# EAGLE design M4_Shield_Solar_Litio_V1.0 (EAGLE 9.5.2)
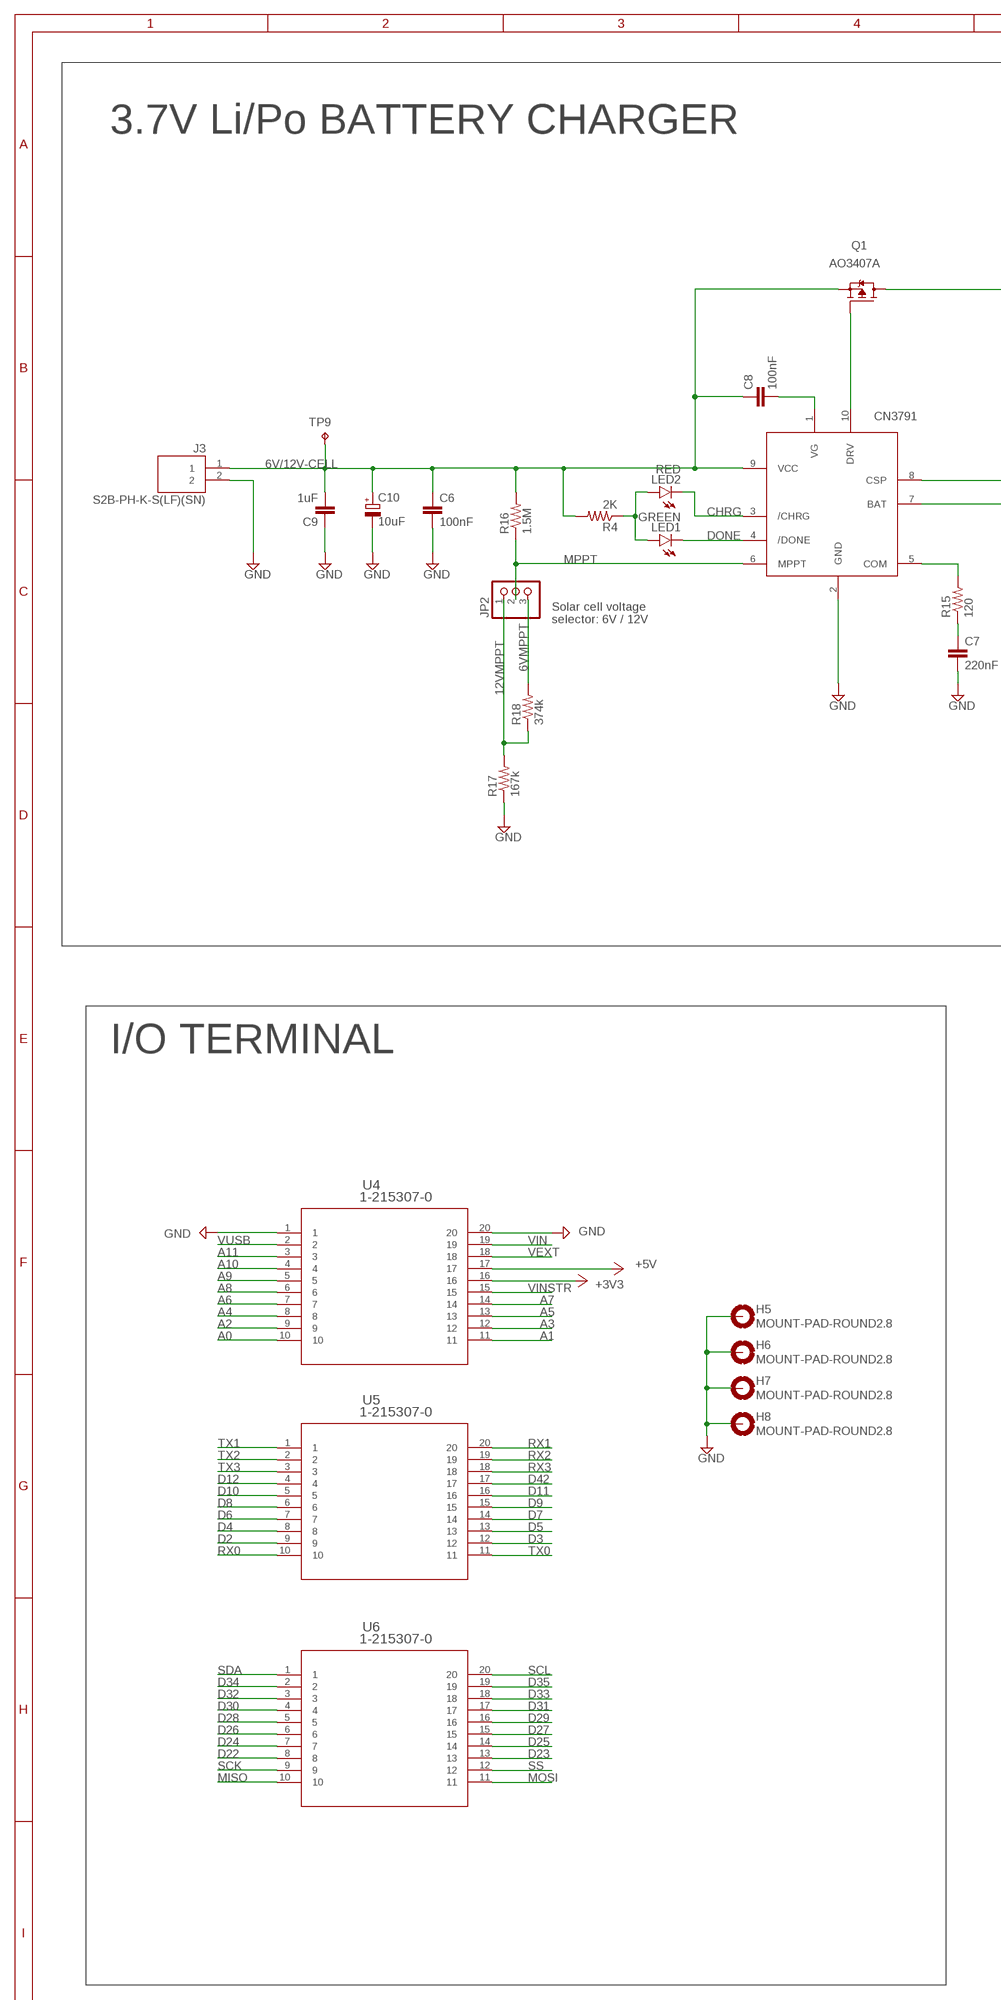
[diagram p0: schematic, sheet 1, part 1 of 2]
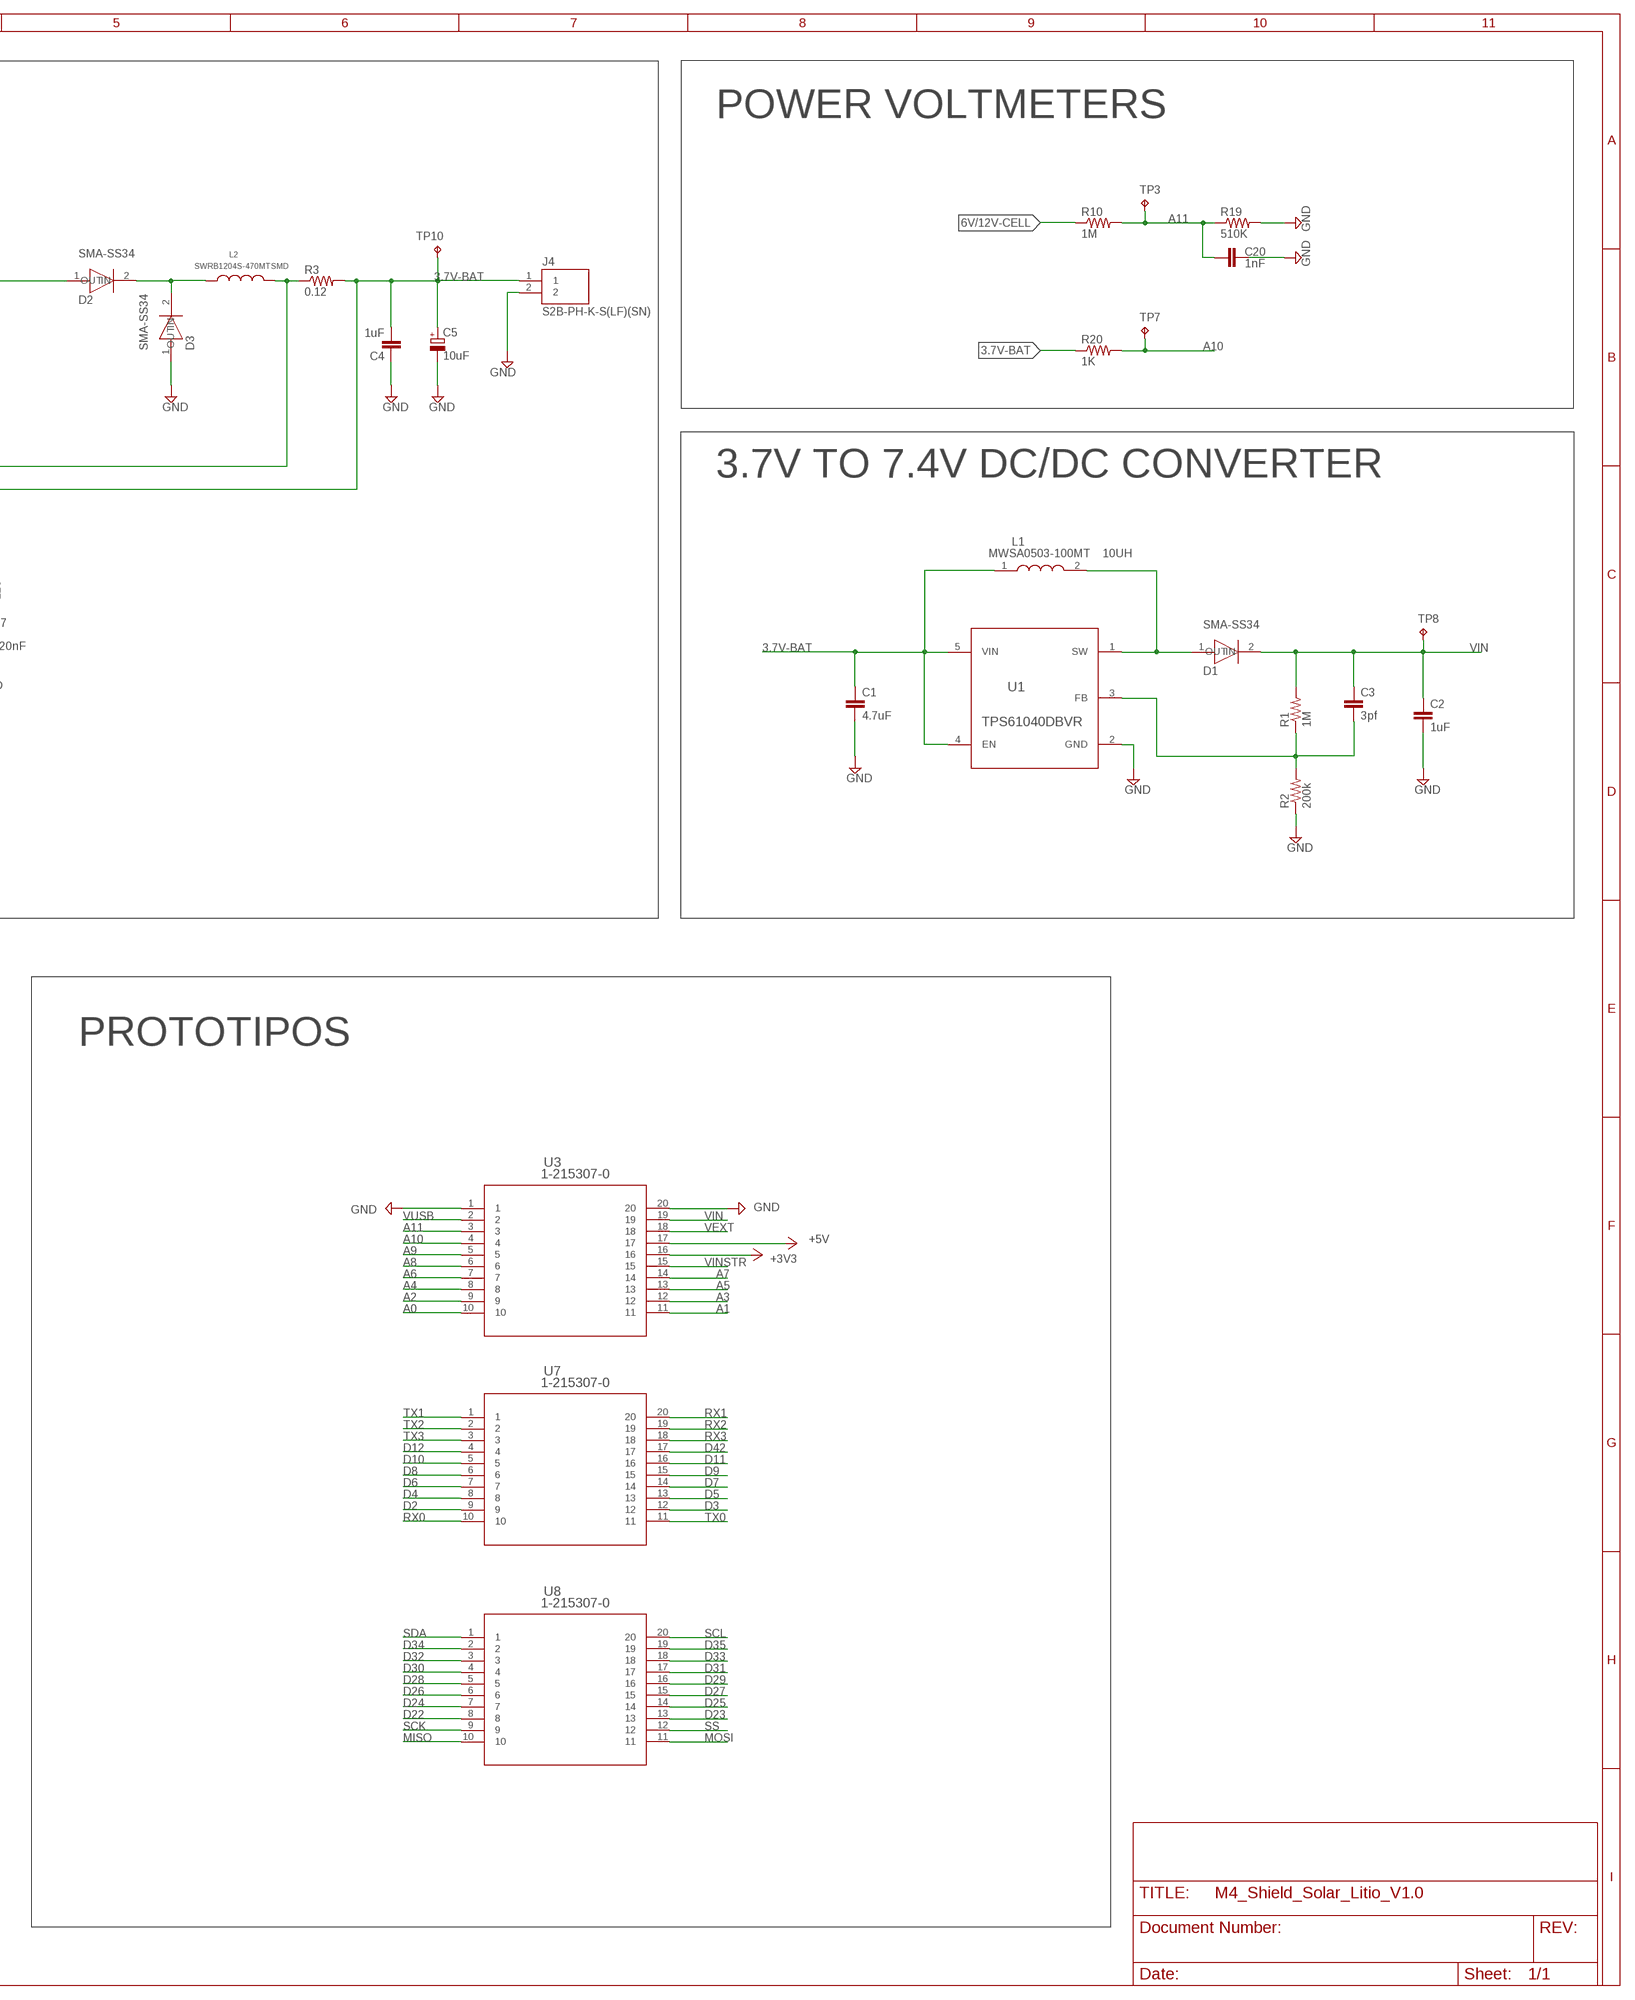
[diagram p1: schematic, sheet 1, part 2 of 2]

## Parts
C1  4.7uF  C-EUC0603K  [C0603K]
C2  1uF  C-EUC0603K  [C0603K]
C3  3pf  C-EUC0603K  [C0603K]
C4  1uF  C-EUC0603K  [C0603K]
C5  10uF  CPOL-EU153CLV-0505  [153CLV-0505]
C6  100nF  C-EUC0603K  [C0603K]
C7  220nF  C-EUC0603K  [C0603K]
C8  100nF  C-EUC0603K  [C0603K]
C9  1uF  C-EUC0603K  [C0603K]
C10  10uF  CPOL-EU153CLV-0505  [153CLV-0505]
C20  1nF  C-EUC0603K  [C0603K]
D1  SMA-SS34  [SMA-SS34]
D2  SMA-SS34  [SMA-SS34]
D3  SMA-SS34  [SMA-SS34]
H5  MOUNT-PAD-ROUND2.8  [2,8-PAD]
H6  MOUNT-PAD-ROUND2.8  [2,8-PAD]
H7  MOUNT-PAD-ROUND2.8  [2,8-PAD]
H8  MOUNT-PAD-ROUND2.8  [2,8-PAD]
J3  S2B-PH-K-S(LF)(SN)  [JST_S2B-PH-K-S(LF)(SN)]
J4  S2B-PH-K-S(LF)(SN)  [JST_S2B-PH-K-S(LF)(SN)]
JP2  PINHD-1X3/90  [1X03/90]
L1  MWSA0503-100MT 10UH  MWSA0503  [MWSA0503]
L2  SWRB1204S-470MTSMD  [SWRB1204S-470MT]
LED1  GREEN  LEDCHIPLED_0603  [CHIPLED_0603]
LED2  RED  LEDCHIPLED_0603  [CHIPLED_0603]
Q1  AO3407A  [SOT95P280X125-3N]
R1  1M  R-US_R0603  [R0603]
R2  200k  R-US_R0603  [R0603]
R3  0.12  R-US_R0805  [R0805]
R4  2K  R-US_R0603  [R0603]
R10  1M  R-US_R0603  [R0603]
R15  120  R-US_R0603  [R0603]
R16  1.5M  R-US_R0603  [R0603]
R17  167k  R-US_R0603  [R0603]
R18  374k  R-US_R0603  [R0603]
R19  510K  R-US_R0603  [R0603]
R20  1K  R-US_R0603  [R0603]
TP3  TPB1,27  [B1,27]
TP7  TPB1,27  [B1,27]
TP8  TPB1,27  [B1,27]
TP9  TPB1,27  [B1,27]
TP10  TPB1,27  [B1,27]
U1  TPS61040DBVR  [DBV0005A]
U2  CN3791  [CN3791]
U3  1-215307-0  [1-215307-0]
U4  1-215307-0  [1-215307-0]
U5  1-215307-0  [1-215307-0]
U6  1-215307-0  [1-215307-0]
U7  1-215307-0  [1-215307-0]
U8  1-215307-0  [1-215307-0]

## Nets
3.7V-BAT: C1.1 C4.2 C5.+ J4.1 L1.1 R3.2 R20.1 TP10.TP U1.4(EN) U1.5(VIN) U2.7(BAT)
6V/12V-CELL: C6.1 C8.1 C9.2 C10.+ J3.1 Q1.2(S) R4.2 R10.1 R16.2 TP9.TP U2.9(VCC)
6VMPPT: JP2.3 R18.2
12VMPPT: JP2.1 R17.2 R18.1
+3V3: U3.16 U4.16
+5V: U3.17 U4.17
A0: U3.10 U4.10
A1: U3.11 U4.11
A2: U3.9 U4.9
A3: U3.12 U4.12
A4: U3.8 U4.8
A5: U3.13 U4.13
A6: U3.7 U4.7
A7: U3.14 U4.14
A8: U3.6 U4.6
A9: U3.5 U4.5
A10: R20.2 TP7.TP U3.4 U4.4
A11: C20.1 R10.2 R19.1 TP3.TP U3.3 U4.3
CHRG: LED2.C U2.3(/CHRG)
D2: U5.9 U7.9
D3: U5.12 U7.12
D4: U5.8 U7.8
D5: U5.13 U7.13
D6: U5.7 U7.7
D7: U5.14 U7.14
D8: U5.6 U7.6
D9: U5.15 U7.15
D10: U5.5 U7.5
D11: U5.16 U7.16
D12: U5.4 U7.4
D22: U6.8 U8.8
D23: U6.13 U8.13
D24: U6.7 U8.7
D25: U6.14 U8.14
D26: U6.6 U8.6
D27: U6.15 U8.15
D28: U6.5 U8.5
D29: U6.16 U8.16
D30: U6.4 U8.4
D31: U6.17 U8.17
D32: U6.3 U8.3
D33: U6.18 U8.18
D34: U6.2 U8.2
D35: U6.19 U8.19
D42: U5.17 U7.17
DONE: LED1.C U2.4(/DONE)
GND: C1.2 C2.2 C4.1 C5.- C6.2 C7.2 C9.1 C10.- C20.2 D3.1(IN) H5.B2,8(MOUNT) H6.B2,8(MOUNT) H7.B2,8(MOUNT) H8.B2,8(MOUNT) J3.2 J4.2 R2.1 R17.1 R19.2 U1.2(GND) U2.2(GND) U3.1 U3.20 U4.1 U4.20
MISO: U6.10 U8.10
MOSI: U6.11 U8.11
MPPT: JP2.2 R16.1 U2.6(MPPT)
N$1: D1.1(IN) L1.2 U1.1(SW)
N$2: D2.2(OUT) D3.2(OUT) L2.1
N$3: C3.2 R1.1 R2.2 U1.3(FB)
N$4: L2.2 R3.1 U2.8(CSP)
N$5: R15.2 U2.5(COM)
N$6: D2.1(IN) Q1.3(D)
N$7: Q1.1(G) U2.10(DRV)
N$12: LED1.A LED2.A R4.1
N$18: C7.1 R15.1
N$22: C8.2 U2.1(VG)
RX0: U5.10 U7.10
RX1: U5.20 U7.20
RX2: U5.19 U7.19
RX3: U5.18 U7.18
SCK: U6.9 U8.9
SCL: U6.20 U8.20
SDA: U6.1 U8.1
SS: U6.12 U8.12
TX0: U5.11 U7.11
TX1: U5.1 U7.1
TX2: U5.2 U7.2
TX3: U5.3 U7.3
VEXT: U3.18 U4.18
VIN: C2.1 C3.1 D1.2(OUT) R1.2 TP8.TP U3.19 U4.19
VINSTR: U3.15 U4.15
VUSB: U3.2 U4.2

## Notes on the sheet
- 3.7V Li/Po BATTERY CHARGER | POWER VOLTMETERS
- 3.7V TO 7.4V DC/DC CONVERTER
- Solar cell voltage 
  selector: 6V / 12V
- I/O TERMINAL
- PROTOTIPOS

## Library data of the parts
C1-C4 C6-C9 C20 = rcl:C-EU: CAPACITOR, European symbol; SPICEPREFIX: C
C5 C10 = rcl:CPOL-EU: POLARIZED CAPACITOR, European symbol; SPICEPREFIX: C
D1-D3 = SMA-SS34:SMA-SS34
H5-H8 = holes:MOUNT-PAD-ROUND: MOUNTING PAD, round
J3 J4 = S2B-PH-K-S_LF__SN_:S2B-PH-K-S(LF)(SN): PH Series 2 Position 2.0 mm Through Hole Side Entry Shrouded Header; DESCRIPTION: Connector Header Through Hole, Right Angle 2 position; DIGI-KEY_PART_NUMBER: 455-1719-ND; DIGI-KEY_PURCHASE_URL: https://www.digikey.com/product-detail/en/jst-sales-america-inc/S2B-PH-K-S_LF__SN_/455-1719-ND/926626?utm_source=snapeda&utm_medium=aggregator&utm_campaign=symbol; MF: JST Sales America Inc.; MP: S2B-PH-K-S_LF__SN_; PACKAGE: Custom Package JST Sales America Inc.
JP2 = pinhead:PINHD-1X3: PIN HEADER
L1 = MWSA0503:MWSA0503: Molded power inductors Source: Datasheet <https://datasheet.lcsc.com/szlcsc/Sunlord-MWSA0503-100MT_C139506.pdf>; DESCRIPTION: Molded power inductors; HEIGHT: 3mm; MANUFACTURER_NAME: SUNLORD; MANUFACTURER_PART_NUMBER: MWSA0503
L2 = SWRB1204S-470MT:SWRB1204S-470MT
LED1 LED2 = led:LED: LED OSRAM: - CHIPLED LG R971, LG N971, LY N971, LG Q971, LY Q971, LO R971, LY R971 LH N974, LH R974 LS Q976, LO Q976, LY Q976 LO Q996 - Hyper CHIPLED LW Q18S LB Q993, LB Q99A, LB R99A - SideLED LS A670, LO A670, LY A670, LG A670, LP A670 LB A673, LV A673, LT A673, LW A673 LH A674 LY A675 LS A676, LA A676, LO A676, LY A676, LW A676 LS A679, LY A679, LG A679 - Hyper Micro SIDELED® LS Y876, LA Y876, LO Y876, LY Y876 LT Y87S - SmartLED LW L88C, LW L88S LB L89C, LB L89S, LG L890 LS L89K, LO L89K, LY L89K LS L896, LA L896, LO L896, LY L896 - TOPLED LS T670, LO T670, LY T670, LG T670, LP T670 LSG T670, LSP T670, LSY T670, LOP T670, LYG T670 LG T671, LOG T671, LSG T671 LB T673, LV T673, LT T673, LW T673 LH T674 LS T676, LA T676, LO T676, LY T676, LB T676, LH T676, LSB T676, LW T676 LB T67C, LV T67C, LT T67C, LS T67K, LO T67K, LY T67K, LW E67C LS E67B, LA E67B, LO E67B, LY E67B, LB E67C, LV E67C, LT E67C LW T67C LS T679, LY T679, LG T679 LS T770, LO T770, LY T770, LG T770, LP T770 LB T773, LV T773, LT T773, LW T773 LH T774 LS E675, LA E675, LY E675, LS T675 LS T776, LA T776, LO T776, LY T776, LB T776 LHGB T686 LT T68C, LB T68C - Hyper Mini TOPLED® LB M676 - Mini TOPLED Santana® LG M470 LS M47K, LO M47K, LY M47K Source: http://www.osram.convergy.de LUXEON: - LUMILED® LXK2-PW12-R00, LXK2-PW12-S00, LXK2-PW14-U00, LXK2-PW14-V00 LXK2-PM12-R00, LXK2-PM12-S00, LXK2-PM14-U00 LXK2-PE12-Q00, LXK2-PE12-R00, LXK2-PE12-S00, LXK2-PE14-T00, LXK2-PE14-U00 LXK2-PB12-K00, LXK2-PB12-L00, LXK2-PB12-M00, LXK2-PB14-N00, LXK2-PB14-P00, LXK2-PB14-Q00 LXK2-PR12-L00, LXK2-PR12-M00, LXK2-PR14-Q00, LXK2-PR14-R00 LXK2-PD12-Q00, LXK2-PD12-R00, LXK2-PD12-S00 LXK2-PH12-R00, LXK2-PH12-S00 LXK2-PL12-P00, LXK2-PL12-Q00, LXK2-PL12-R00 Source: www.luxeon.com KINGBRIGHT: KA-3528ASYC Source: www.kingbright.com
Q1 = AO3407A:AO3407A: Transistor: P-MOSFET; unipolar; -30V; -4.3A; 1.4W; DESCRIPTION: P-Channel 30V 4.3A (Ta) 1.4W (Ta) Surface Mount SOT-23-3L; DIGI-KEY_PART_NUMBER: 785-1006-1-ND; DIGIKEY-PURCHASE-URL: https://snapeda.com/shop?store=DigiKey&id=547767; MF: Alpha &; MP: AO3407A; PACKAGE: SOT-23 Alpha &amp; Omega Semiconductor
R1-R4 R10 R15-R20 = rcl:R-US_: RESISTOR, American symbol; SPICEPREFIX: R
TP3 TP7-TP10 = testpad:TP: Test pad
U1 = TPS61040DBVR:TPS61040DBVR; COMPTYPE: IC; MANUFACTURER: Texas Instruments; MOUNTTYPE: SMT; PACKAGEREFERENCE: DBV0005A; PARTNUMBER: TPS61040DBVR; PIN_COUNT: 5; REFDES: RefDes; ROHS: Y; SYMBOLVERISON: 2014-09-09; TYPE: TYPE; VALUE: Value
U2 = CN3791:CN3791
U3-U8 = 1-215307-0:1-215307-0; BUILT_BY: EMA_UL_Team; MANUFACTURER_PART_NUMBER: 1-215307-0; VENDOR: TE Connectivity

## Board
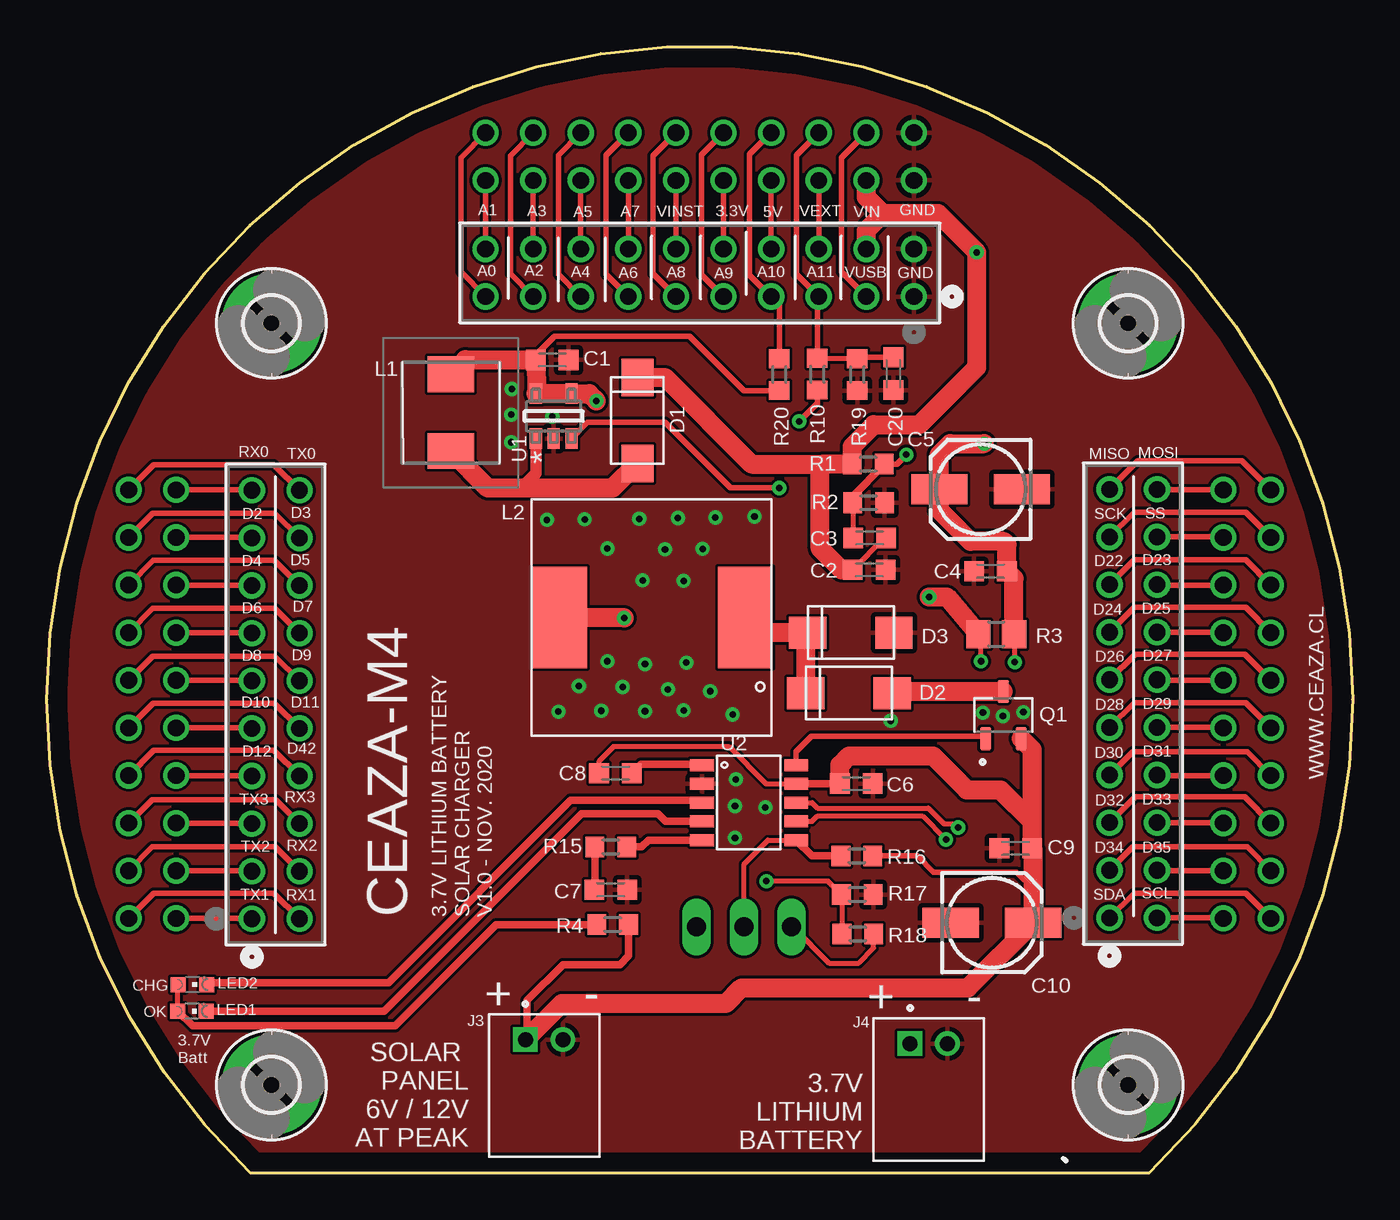
[diagram p2: board, top side]
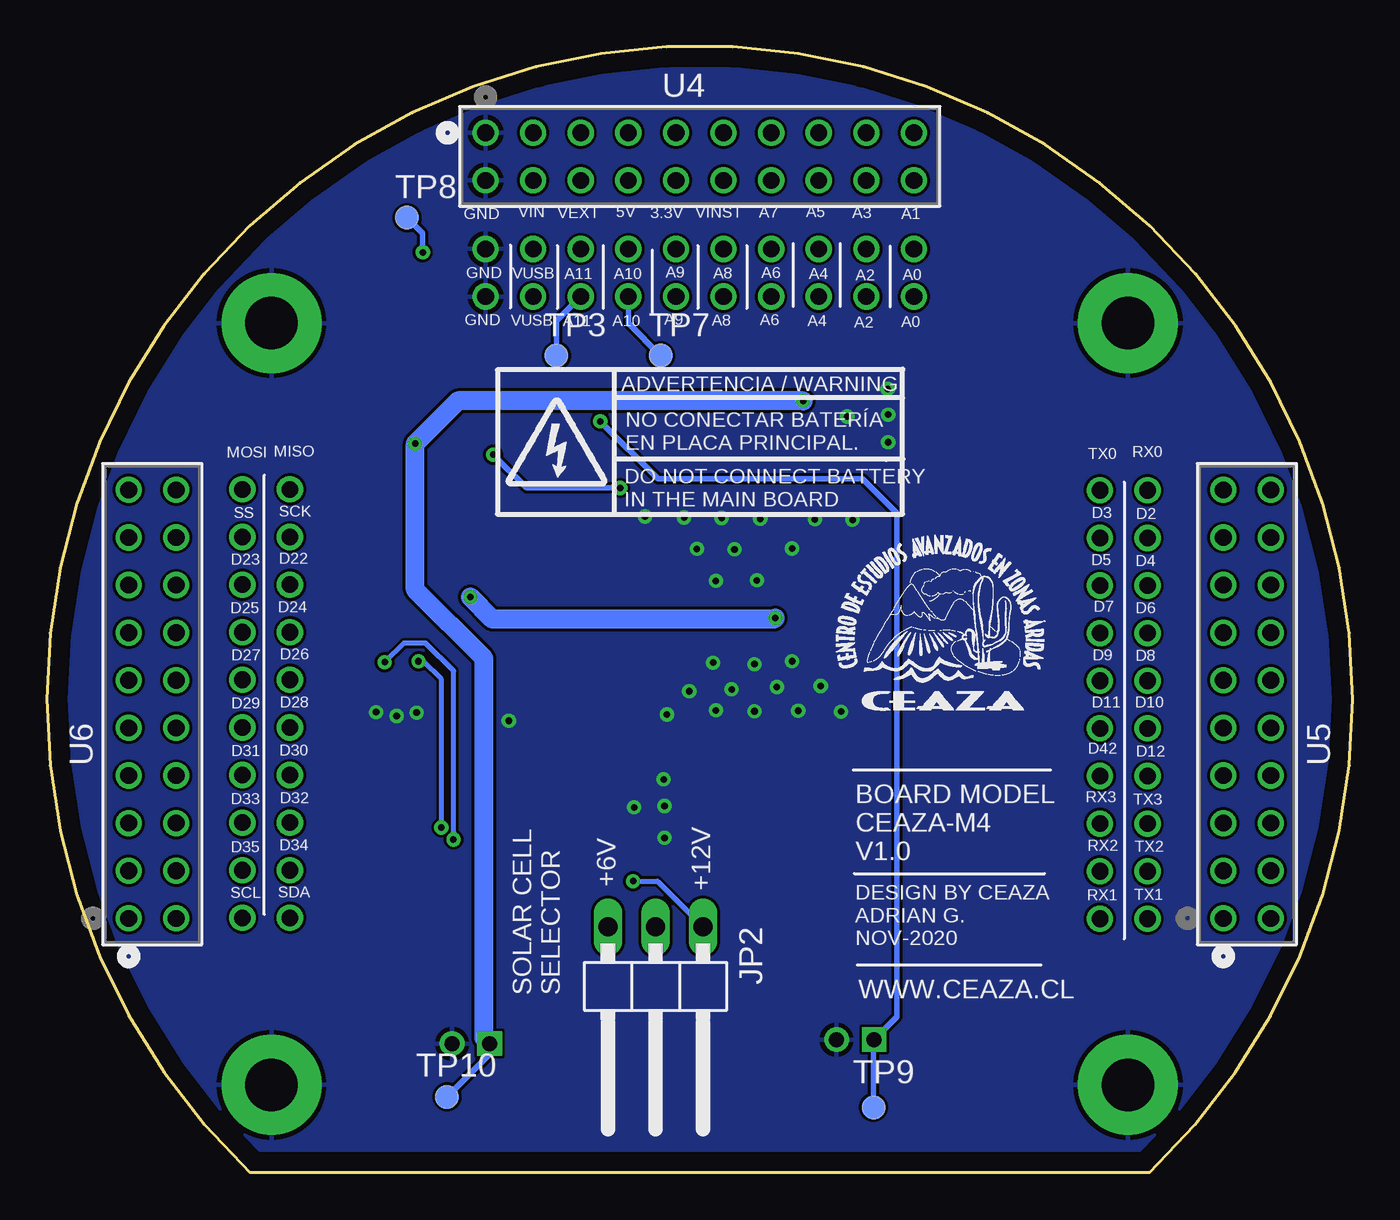
[diagram p3: board, bottom side, seen from below]

Size 69.69 x 60.06 mm. Coordinates in mm from the lower left corner, seen from the top.
Outline: 10.85,0 58.85,0 arc273 10.85,0
Copper layers (1*16): Top 0.035mm / dielectric 1.5mm / Bottom 0.035mm
Design rules "default *": minimum track width 6mil, minimum drill 0.35mm, track to track 6mil, track to pad 6mil, pad to pad 6mil, via to via 6mil, smd to smd 6mil, copper to edge 40mil, drill to drill 6mil, minimum pad ring 10mil, minimum via ring 8mil, stop-mask expansion 2mil, vias tented up to drill 24mil, thermal gap 10mil

### Footprints (pad centres in the part's own frame; a part is rotated, then mirrored left to right if it is on the bottom)
C0603K = smd 1.05 x 1.08: 1 -0.875,0; 2 0.875,0
153CLV-0505 = smd 3 x 1.6: + 2.2,0; - -2.2,0
SMA-SS34 = smd 2 x 1.7: 1 0,-1.4; 2 4.6,-1.4
2,8-PAD = drill 2.8 pad 5.334: B2,8 0,0
JST_S2B-PH-K-S(LF)(SN) = drill 0.8 square: 1 -1,0 | drill 0.8: 2 1,0
1X03/90 = drill 1.016 long: 1 -2.54,-3.81; 2 0,-3.81; 3 2.54,-3.81
MWSA0503 = smd 1.9 x 2.5: 1 -2.05,0; 2 2.05,0
SWRB1204S-470MT = smd 2.9 x 5.4: 1 -5.2,0; 2 4.7,0
CHIPLED_0603 = smd 0.8 x 0.8: A 0,-0.75; C 0,0.75
SOT95P280X125-3N = smd 1.21 x 0.59: 1 -1.255,0.95; 2 -1.255,-0.95; 3 1.255,0
R0603 = smd 1 x 1.1: 1 -0.85,0; 2 0.85,0
R0805 = smd 1.3 x 1.5: 1 -0.95,0; 2 0.95,0
B1,27 = smd 1.27 x 1.27: TP 0,0
DBV0005A = smd 1.1 x 0.65: 1 -1.2,0.95; 2 -1.2,0; 3 -1.2,-0.95; 4 1.2,-0.95; 5 1.2,0.95
CN3791 = smd 1.27 x 0.635: 1 -2.5,1.9; 2 -2.5,0.9; 3 -2.5,-0.1; 4 -2.5,-1.1; 5 -2.5,-2.1; 6 2.53,-2.1; 7 2.53,-1.1; 8 2.53,-0.1; 9 2.53,0.9; 10 2.53,1.9
1-215307-0 = drill 0.889 pad 1.397: 1 -22.86,2.54; 2 -20.32,2.54; 3 -17.78,2.54; 4 -15.24,2.54; 5 -12.7,2.54; 6 -10.16,2.54; 7 -7.62,2.54; 8 -5.08,2.54; 9 -2.54,2.54; 10 0,2.54; 11 0,0; 12 -2.54,0; 13 -5.08,0; 14 -7.62,0; 15 -10.16,0; 16 -12.7,0; 17 -15.24,0; 18 -17.78,0; 19 -20.32,0; 20 -22.86,0

### Placement (x,y rotation side)
C1  26.97,43.36 0 top
C2  43.89,32.16 0 top
C3  43.91,33.86 180 top
C4  50.37,32.09 0 top
C5  49.83,36.46 180 top
C6  43.2,20.76 0 top
C7  30.1,15.09 0 top
C8  30.35,21.32 0 top
C9  51.71,17.3 0 top
C10  50.44,13.34 0 top
C20  45.18,42.63 270 top
D1  30.12,37.83 90 top
D2  45.11,24.19 180 top
D3  45.21,27.41 180 top
H5  57.71,45.32 0 top
H6  11.99,45.32 0 top
H7  11.99,4.68 0 top
H8  57.71,4.68 0 top
J3  26.54,7.09 0 top
J4  47.06,6.89 0 top
JP2  37.21,9.3 180 bottom
L1  21.56,40.54 270 top
L2  32.08,29.62 180 top
LED1  7.74,8.62 270 top
LED2  7.77,10.04 270 top
Q1  51.05,24.42 90 top
R1  43.84,37.8 180 top
R2  43.86,35.74 180 top
R3  50.67,28.73 0 top
R4  30.2,13.24 0 top
R10  41.12,42.6 90 top
R15  30.1,17.38 0 top
R16  43.23,16.9 0 top
R17  43.25,14.84 180 top
R18  43.28,12.73 0 top
R19  43.25,42.58 270 top
R20  39.09,42.58 90 top
TP3  42.49,43.59 0 bottom
TP7  36.93,43.59 0 bottom
TP8  50.47,50.96 0 bottom
TP9  25.57,3.49 0 bottom
TP10  48.33,4.04 0 bottom
U1  27.05,40.37 90 top
U2  37.46,19.84 0 top
U3  23.42,49.28 180 top
U4  23.42,52.94 0 bottom
U5  4.37,36.43 90 bottom
U6  62.79,36.43 90 bottom
U7  13.48,36.4 90 top
U8  59.26,36.46 90 top

### Tracks (layer width: path | path; a pad name or v marks a point on that pad's centre or on a via)
3.7V-BAT  (via drill 0.35)
  Top 0.254: U2.7 40.84,18.74 41.13,19.04 46.72,19.04 v47.99,17.77 | v51.66,27.23 51.66,28.69 R3.2
  Top 0.305: R20.1 37.19,41.73 34.29,44.63 27.09,44.63 26.1,43.64 C1.1
  Top 1.016: 26.13,41.6 C1.1 22.34,43.38 L1.1 | 26.13,41.6 U1.5 | 26.13,41.6 26.17,41.57 U1.4 28.95,41.57 v29.33,41.18 | R3.2 51.62,31.71 C4.2 51.24,33.52 51.08,33.69 49.3,33.69 47.63,35.35 C5.+ 47.63,38.32 48.21,38.89 v50.03,38.89
  Bottom 0.254: v47.99,17.77 47.99,18.13 47.98,18.14 47.98,26.77 49.47,28.26 50.64,28.26 v51.66,27.23
  Bottom 0.305: TP10.TP 46.06,6.31 J4.1
  Bottom 1.016: J4.1 46.37,7.19 46.37,27.44 50.03,31.1 v50.03,38.89 47.75,41.18 v29.33,41.18
6V/12V-CELL  (via drill 0.35)
  Top 0.254: C8.1 29.47,21.95 30.26,22.74 36.39,22.74 38.39,20.74 U2.9
  Top 0.305: R16.2 46.45,16.9 47.32,16.03 51.75,16.03 52.64,15.14 | C9.2 52.59,18.08 | R10.1 41.12,41.05 v40.15,40.09
  Top 0.406: U2.9 40.01,20.76 C6.1 | J3.1 25.64,7.19 25.64,9.2 27.54,11.1 30.59,11.1 31.05,11.56 R4.2
  Top 1.016: J3.1 27.47,9.02 36.24,9.02 37.08,9.86 49.16,9.86 C10.+ 52.64,15.14 52.64,17.25 C9.2 | C9.2 52.59,17.88 | C6.1 42.33,21.74 42.82,22.23 47.29,22.23 49.09,20.43 50.9,20.43 52.59,18.74 | C9.2 52.59,18.74 | 52.59,18.74 52.59,22.57 Q1.2
  Bottom 0.305: TP9.TP 25.57,7.06 J3.1 24.32,8.31 24.32,35.17 26.16,37.01 37.08,37.01 v40.15,40.09
6VMPPT
  Top 0.254: JP2.3 39.82,13.11 41.75,11.18 43.33,11.18 44.13,11.98 R18.2
12VMPPT  (via drill 0.35)
  Top 0.254: R18.1 42.43,14.81 R17.2 41.69,15.55 v38.4,15.55
  Bottom 0.254: v38.4,15.55 37.11,15.55 JP2.1
+3V3
  Top 0.305: U4.16 U3.16
+5V
  Top 0.305: U3.17 U4.17
A0
  Top 0.305: U3.10 22.09,48.06 22.09,54.16 U4.10
A1
  Top 0.305: U3.11 U4.11
A2
  Top 0.305: U3.9 24.74,47.96 24.74,54.26 U4.9
A3
  Top 0.305: U4.12 U3.12
A4
  Top 0.305: U3.8 27.3,47.94 27.3,54.29 U4.8
A5
  Top 0.305: U3.13 U4.13
A6
  Top 0.305: U3.7 29.84,47.94 29.84,54.29 U4.7
A7
  Top 0.305: U4.14 U3.14
A8
  Top 0.305: U3.6 32.36,47.96 32.36,54.26 U4.6
A9
  Top 0.305: U3.5 34.95,47.91 34.95,54.31 U4.5
A10
  Top 0.305: R20.2 39.09,46.31 U3.4 37.51,47.88 37.51,54.34 U4.4
  Bottom 0.305: TP7.TP 38.66,45.32 U3.4
A11
  Top 0.305: C20.1 43.33,43.5 R19.1 42.87,43.43 R10.2 41.12,46.67 U3.3 40,47.94 40,54.29 U4.3
  Bottom 0.305: TP3.TP 42.49,45.45 U3.3
CHRG
  Top 0.406: LED2.C 8.62,10.14 18.23,10.14 27.96,19.87 34.84,19.87 U2.3
D2
  Top 0.305: U5.9 10.92,33.89 U7.9
D3
  Top 0.305: U5.12 5.66,35.18 12.16,35.18 U7.12
D4
  Top 0.305: U5.8 10.92,31.35 U7.8
D5
  Top 0.305: U5.13 5.69,32.67 12.14,32.67 U7.13
D6
  Top 0.305: U5.7 10.92,28.81 U7.7
D7
  Top 0.305: U5.14 5.66,30.1 12.16,30.1 U7.14
D8
  Top 0.305: U5.6 10.92,26.27 U7.6
D9
  Top 0.305: U5.15 5.66,27.56 12.16,27.56 U7.15
D10
  Top 0.305: U5.5 10.92,23.73 U7.5
D11
  Top 0.305: U5.16 5.69,25.05 12.14,25.05 U7.16
D12
  Top 0.305: U5.4 10.92,21.19 U7.4
D22
  Top 0.305: U8.8 58.04,32.7 63.98,32.7 U6.8
D23
  Top 0.305: U6.13 59.28,31.35 U8.13
D24
  Top 0.305: U8.7 58.04,30.16 63.98,30.16 U6.7
D25
  Top 0.305: U8.14 62.76,28.84 U6.14
D26
  Top 0.305: U8.6 58.09,27.67 63.93,27.67 U6.6
D27
  Top 0.305: U6.15 59.28,26.27 U8.15
D28
  Top 0.305: U8.5 58.04,25.08 63.98,25.08 U6.5
D29
  Top 0.305: U8.16 62.76,23.75 U6.16
D30
  Top 0.305: U8.4 57.96,22.46 64.06,22.46 U6.4
D31
  Top 0.305: U6.17 59.28,21.19 U8.17
D32
  Top 0.305: U8.3 58.09,20.05 63.93,20.05 U6.3
D33
  Top 0.305: U8.18 62.76,18.67 U6.18
D34
  Top 0.305: U8.2 57.96,17.38 64.06,17.38 U6.2
D35
  Top 0.305: U6.19 59.28,16.11 U8.19
D42
  Top 0.305: U5.17 5.71,22.54 12.11,22.54 U7.17
DONE
  Top 0.406: LED1.C 18.01,8.62 28.55,19.16 32.61,19.16 33.02,18.74 U2.4
GND  (via drill 0.35)
  other vias: 36.73,17.86 36.73,19.56 38.35,19.49 36.78,20.99 27.3,24.59 29.59,24.64 31.92,24.62 33.98,24.67 36.6,24.44 35.4,25.69 33.14,25.79 30.73,25.91 28.39,25.97 34.13,27.21 31.92,27.13 29.92,27.29 31.8,31.6 33.98,31.58 35,33.28 32.99,33.25 29.92,33.31 37.77,35.01 35.68,34.96 33.68,34.93 31.62,34.88 28.7,34.86 26.69,34.83 52.12,24.57 51.03,24.36 49.96,24.54 45.03,24.11 24.79,38.97 24.79,40.44 24.81,41.81 26.97,40.34
  pour Top: -4.52,42.78 -4.52,13.57 10.72,-1.67 60.25,-1.67 70.41,8.49 70.41,40.24 48.82,61.83 14.53,61.83
  pour Bottom: -1.98,42.78 -1.98,11.03 11.99,-2.94 60.25,-2.94 70.41,7.22 70.41,41.51 50.09,61.83 17.07,61.83
MISO
  Top 0.305: U8.10 58.24,37.98 63.78,37.98 U6.10
MOSI
  Top 0.305: U6.11 59.28,36.43 U8.11
MPPT
  Top 0.254: JP2.2 37.21,16.47 38.49,17.74 U2.6
  Top 0.406: R16.1 40.84,16.9 U2.6
N$1
  Top 0.61: U1.1 26.1,37.31 25.32,36.53
  Top 1.016: D1.1 30.2,36.53 25.32,36.53 23.53,36.53 L1.2
N$2
  Top 1.016: D2.2 40.51,28.71 D3.2 38.09,28.81 L2.1
N$3  (via drill 0.35)
  Top 0.254: C3.2 43.04,35.72 R2.2
  Top 0.305: R1.1 45.36,37.8 v45.87,38.31 | v39.09,36.53 36.5,36.53 32.99,40.04 28.87,40.04 U1.3
  Top 0.406: R1.1 44.7,37.79 44.65,37.74 43.01,36.1 R2.2
  Bottom 0.305: v45.87,38.31 44.09,36.53 v39.09,36.53
N$4  (via drill 0.35)
  Top 0.254: U2.8 40.84,19.74 41.13,19.45 47.04,19.45 47.88,18.61 48.39,18.61 48.58,18.42 v48.63,18.42 | v49.86,27.29 49.86,28.6 R3.1
  Top 1.016: v30.81,29.6 30.78,29.62 L2.2 | v47.09,30.71 48.02,30.71 R3.1
  Bottom 0.254: v48.63,18.42 48.63,26.32 49.6,27.29 v49.86,27.29
  Bottom 1.016: v30.81,29.6 30.86,29.55 45.92,29.55 v47.09,30.71
N$5
  Top 0.406: U2.5 32.11,17.74 31.74,17.38 R15.2
N$6
  Top 1.016: Q1.3 45.19,25.67 D2.1
N$7
  Top 0.305: U2.10 39.99,22.45 40.81,23.27 49.99,23.27 Q1.1
N$12
  Top 0.254: LED1.A 6.99,10.01 LED2.A
  Top 0.406: LED1.A 7.78,7.83 18.58,7.83 23.99,13.24 R4.1
N$18
  Top 0.406: R15.1 29.25,15.12 C7.1
N$22
  Top 0.406: U2.1 34.91,21.8 31.71,21.8 C8.2
RX0
  Top 0.305: U5.10 10.92,36.43 U7.10
RX1
  Top 0.305: U5.20 5.71,14.92 12.11,14.92 U7.20
RX2
  Top 0.305: U5.19 5.64,17.38 12.19,17.38 U7.19
RX3
  Top 0.305: U5.18 5.61,19.89 12.21,19.89 U7.18
SCK
  Top 0.305: U8.9 58.04,35.24 63.98,35.24 U6.9
SCL
  Top 0.305: U8.20 62.76,13.6 U6.20
SDA
  Top 0.305: U8.1 58.04,14.92 63.98,14.92 U6.1
SS
  Top 0.305: U8.12 62.76,33.91 U6.12
TX0
  Top 0.305: U5.11 5.71,37.78 12.11,37.78 U7.11
TX1
  Top 0.305: U5.1 10.92,13.57 U7.1
TX2
  Top 0.305: U5.2 10.92,16.11 U7.2
TX3
  Top 0.305: U5.3 10.92,18.65 U7.3
VEXT
  Top 0.305: U4.18 U3.18
VIN  (via drill 0.35)
  Top 0.254: C2.1 44.71,33.86 C3.1
  Top 1.016: C2.1 42.41,32.16 41.27,33.31 41.27,37.65 41.42,37.8 | 41.42,37.8 R1.2 42.99,38.75 44.14,39.91 46.58,39.91 49.63,42.96 v49.63,49.1 47.57,51.16 44.62,51.16 | D1.2 32.99,42.43 37.61,37.8 41.42,37.8 | 44.62,51.16 43.74,52.05 U4.19 | U3.19 43.74,50.27 44.62,51.16
  Bottom 0.305: TP8.TP 49.63,50.12 v49.63,49.1
VINSTR
  Top 0.305: U3.15 U4.15
VUSB
  Top 0.305: U3.2 42.41,48.06 42.41,54.16 U4.2

### Text on the board
tPlace: WWW.CEAZA.CL | CEAZA-M4 | 3.7V LITHIUM BATTERY / SOLAR CHARGER / V1.0 - NOV. 2020 | + | - | + | - | 3.7V / Batt | SOLAR / PANEL / 6V / 12V / AT PEAK | 3.7V / LITHIUM / BATTERY
bPlace: ADVERTENCIA / WARNING | NO CONECTAR BATERÍA / EN PLACA PRINCIPAL. | DO NOT CONNECT BATTERY / IN THE MAIN BOARD | BOARD MODEL / CEAZA-M4 / V1.0 | +12V | +6V | DESIGN BY CEAZA / ADRIAN G. / NOV-2020 | WWW.CEAZA.CL | SOLAR CELL / SELECTOR
tNames: A1 | A3 | A5 | A7 | VINST | 3.3V | 5V | VEXT | VIN | GND | A0 | A2 | A4 | A6 | A8 | A9 | A10 | A11 | VUSB | GND | RX0 | TX0 | MISO | MOSI | D3 | SS | D2 | SCK | D4 | D5 | D22 | D23 | D7 | D6 | D24 | D25 | D8 | D9 | D26 | D27 | D10 | D11 | D28 | D29 | D12 | D42 | D30 | D31 | TX3 | RX3 | D32 | D33 | TX2 | RX2 | D34 | D35 | TX1 | RX1 | SDA | SCL | CHG | OK
bNames: A1 | A3 | A5 | A7 | VINST | 3.3V | 5V | VEXT | VIN | GND | A0 | A2 | A4 | A6 | A8 | A9 | A10 | A11 | VUSB | GND | A0 | A2 | A4 | A6 | A8 | A9 | A10 | A11 | VUSB | GND | RX0 | TX0 | MISO | MOSI | D3 | SCK | SS | D2 | D4 | D5 | D22 | D23 | D7 | D24 | D6 | D25 | D8 | D9 | D26 | D27 | D10 | D11 | D28 | D29 | D12 | D42 | D30 | D31 | TX3 | RX3 | D32 | D33 | TX2 | RX2 | D34 | D35 | TX1 | RX1 | SDA | SCL